# EAGLE design wifilamp3 (EAGLE 7.7.0)
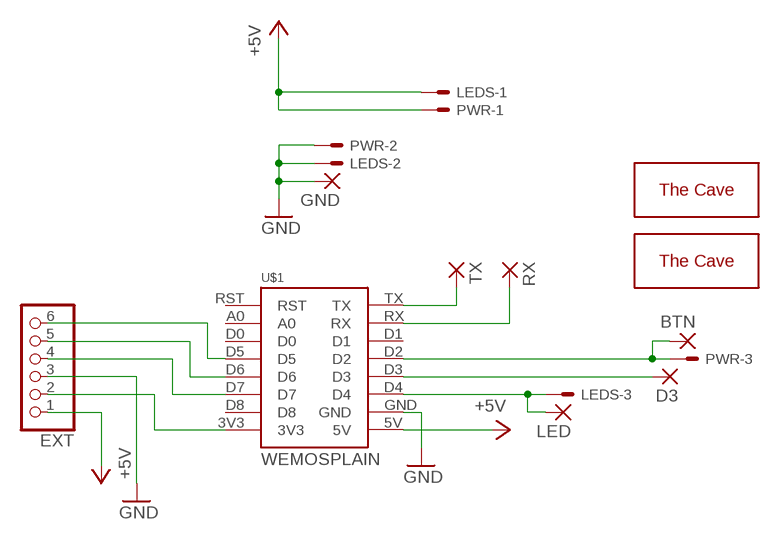
[diagram p0: schematic, sheet 1]

## Parts
BTN  WIREPADSMD1,27-254  [SMD1,27-2,54]
D3  WIREPADSMD1,27-254  [SMD1,27-2,54]
EXT  PINHD-1X6  [1X06]
GND  WIREPADSMD1,27-254  [SMD1,27-2,54]
LED  WIREPADSMD1,27-254  [SMD1,27-2,54]
LEDS  JST-XH-03-PIN-LONG-PAD  [JST-XH-03-PACKAGE-LONG-PAD]
PWR  JST-XH-03-PIN-LONG-PAD  [JST-XH-03-PACKAGE-LONG-PAD]
RX  WIREPADSMD1,27-254  [SMD1,27-2,54]
TX  WIREPADSMD1,27-254  [SMD1,27-2,54]
U$1  WEMOSPLAIN  [WEMOS-PLAIN]
U$2  THECAVE_LOGO_TOP_MEDIUM  [LOGO_TOP_MED]
U$3  THECAVE_LOGO_BOTTOM_MEDIUM  [LOGO_BOT_MED]

## Nets
+5V: EXT.1 LEDS.1 PWR.1 U$1.5V
GND: EXT.3 GND.1(P) LEDS.2 PWR.2 U$1.GND
N$1: LED.1(P) LEDS.3 U$1.D4
N$2: BTN.1(P) PWR.3 U$1.D2
N$3: TX.1(P) U$1.TX
N$4: EXT.2 U$1.3V3
N$5: EXT.4 U$1.D7
N$6: EXT.5 U$1.D6
N$7: EXT.6 U$1.D5
N$8: RX.1(P) U$1.RX
N$9: D3.1(P) U$1.D3
Unconnected: U$1.A0 U$1.D0 U$1.D1 U$1.D8 U$1.RST

## Library data of the parts
BTN D3 GND LED RX TX = wirepad:WIREPAD: Wire PAD connect wire on PCB
EXT = pinhead:PINHD-1X6: PIN HEADER
LEDS PWR = Rembrandt Electronics - JST XH Connectors v1-0:JST-XH-03-PIN: JST XH Connector 2 Pin Wire to board connector. Pitch: 2,54 mm, (0.100") Number of pins: 3 Created by Rembrandt Electronics www.rembrandtelectronics.com
U$1 = d1-mini:WEMOS
U$2 U$3 = thecave:THECAVE_LOGO: The Cave DIY workshop logos thecave.cz

## Board
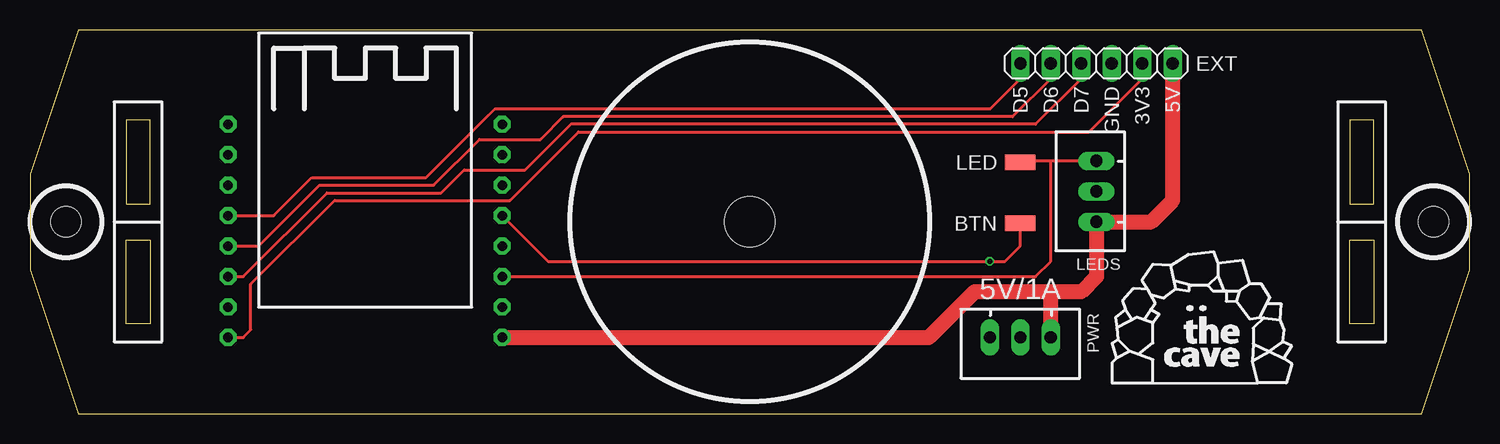
[diagram p1: board, top side]
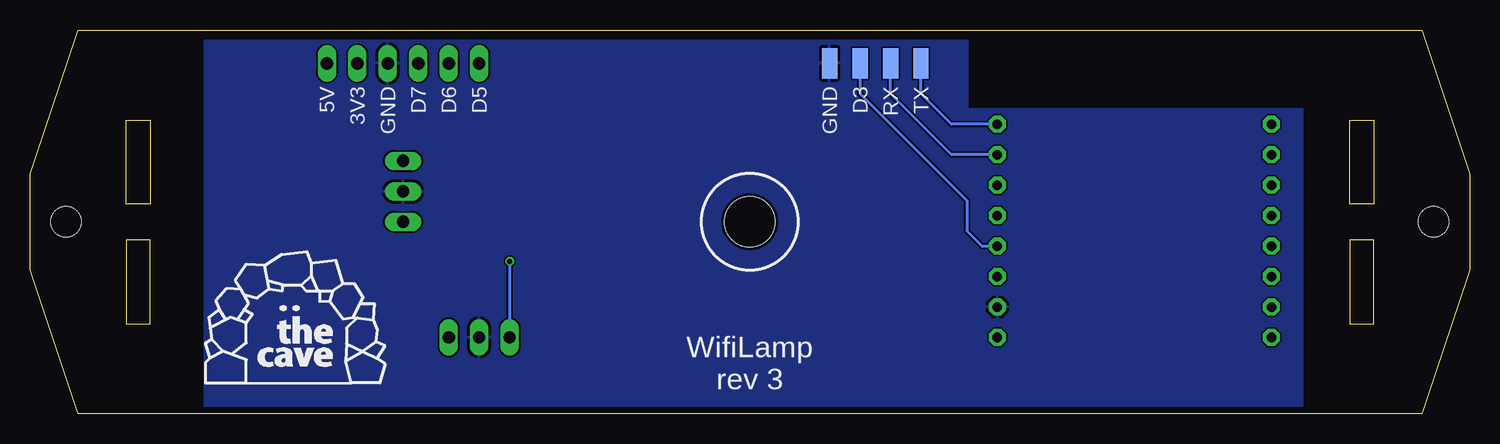
[diagram p2: board, bottom side, seen from below]

Size 120 x 32 mm. Coordinates in mm from the lower left corner, seen from the top.
Outline: 4,0 116,0 120,12 120,20 116,32 4,32 0,20 0,12 4,0
Copper layers (1*16): Top 0.035mm / dielectric 1.5mm / Bottom 0.035mm
Design rules "SeeedStudio_2layer_DRU_no_angle_20140221 *": minimum track width 6mil, minimum drill 12mil, track to track 6mil, track to pad 6mil, pad to pad 6mil, via to via 6mil, smd to smd 0mil, copper to edge 10mil, drill to drill 10mil, minimum pad ring 10mil, minimum via ring 6mil, stop-mask expansion 2mil, vias tented up to drill 0.4mm, thermal gap 10mil
Holes 2.5 mm at 3,16 117,16
Holes 4.2 mm at 60,16
Milling: 16 lines

### Footprints (pad centres in the part's own frame; a part is rotated, then mirrored left to right if it is on the bottom)
SMD1,27-2,54 = smd 1.27 x 2.54: 1 0,0
1X06 = drill 1.016 long: 1 -6.35,0; 2 -3.81,0; 3 -1.27,0; 4 1.27,0; 5 3.81,0; 6 6.35,0
JST-XH-03-PACKAGE-LONG-PAD = drill 1.016 long: 1 -2.54,0; 2 0,0; 3 2.54,0
WEMOS-PLAIN = drill 0.8 pad 1.422 octagon: 3V3 0,0; 5V 22.86,0; A0 0,15.24; D0 0,12.7; D1 22.86,12.7; D2 22.86,10.16; D3 22.86,7.62; D4 22.86,5.08; D5 0,10.16; D6 0,7.62; D7 0,5.08; D8 0,2.54; GND 22.86,2.54; RST 0,17.78; RX 22.86,15.24; TX 22.86,17.78

### Placement (x,y rotation side)
BTN  82.55,15.88 270 top
D3  50.8,29.21 0 bottom
EXT  88.9,29.21 180 top
GND  53.34,29.21 0 bottom
LED  82.55,20.95 270 top
LEDS  88.9,18.54 90 top
PWR  82.55,6.35 180 top
RX  48.26,29.21 0 bottom
TX  45.72,29.21 0 bottom
U$1  16.51,6.35 0 top
U$2  90.17,2.54 0 top
U$3  90.17,2.54 0 top

### Tracks (layer width: path | path; a pad name or v marks a point on that pad's centre or on a via)
+5V
  Top 1.27: U$1.5V 74.93,6.35 78.74,10.16 85.09,10.16 | 85.09,10.16 87.63,10.16 88.9,11.43 LEDS.1 93.47,16 95.25,17.78 EXT.1 | PWR.1 85.09,10.16
GND
  pour Bottom: 13.97,25.4 13.97,0.64 105.41,0.64 105.41,31.11 41.91,31.11 41.91,25.4
N$1
  Top 0.254: U$1.D4 83.82,11.43 85.09,12.7 85.09,21.08 | LEDS.3 85.09,21.08 | 85.09,21.08 82.55,21.08 LED.1
N$2  (via drill 0.4)
  Top 0.254: BTN.1 82.55,13.97 81.28,12.7 v80.01,12.7 43.18,12.7 U$1.D2
  Bottom 0.254: v80.01,12.7 PWR.3
N$3
  Bottom 0.254: U$1.TX 43.18,24.13 45.72,26.67 TX.1
N$4
  Top 0.254: U$1.3V3 17.78,6.35 18.41,6.99 18.41,10.79 25.4,17.78 40.01,17.78 45.72,23.5 88.27,23.5 92.71,27.94 EXT.2
N$5
  Top 0.254: EXT.4 87.63,27.94 83.82,24.13 45.09,24.13 41.27,20.32 36.2,20.32 34.29,18.41 24.77,18.41 17.78,11.43 U$1.D7
N$6
  Top 0.254: EXT.5 85.09,27.94 81.92,24.77 44.45,24.77 42.55,22.86 37.47,22.86 33.66,19.05 24.13,19.05 19.05,13.97 U$1.D6
N$7
  Top 0.254: U$1.D5 20.32,16.51 23.5,19.68 33.02,19.68 38.73,25.4 80.01,25.4 82.55,27.94 EXT.6
N$8
  Bottom 0.254: U$1.RX 43.18,21.59 48.26,26.67 RX.1
N$9
  Bottom 0.254: D3.1 50.8,26.67 41.91,17.78 41.91,15.24 40.64,13.97 U$1.D3

### Text on the board
tPlace: D5 | D6 | D7 | GND | 3V3 | 5V | 5V/1A
bPlace: D5 | D6 | D7 | GND | 3V3 | 5V | WifiLamp / rev 3